# Altium schematic sheet Sheet1.SchDoc
size A3; SheetNumber: 1; SheetTotal: 2
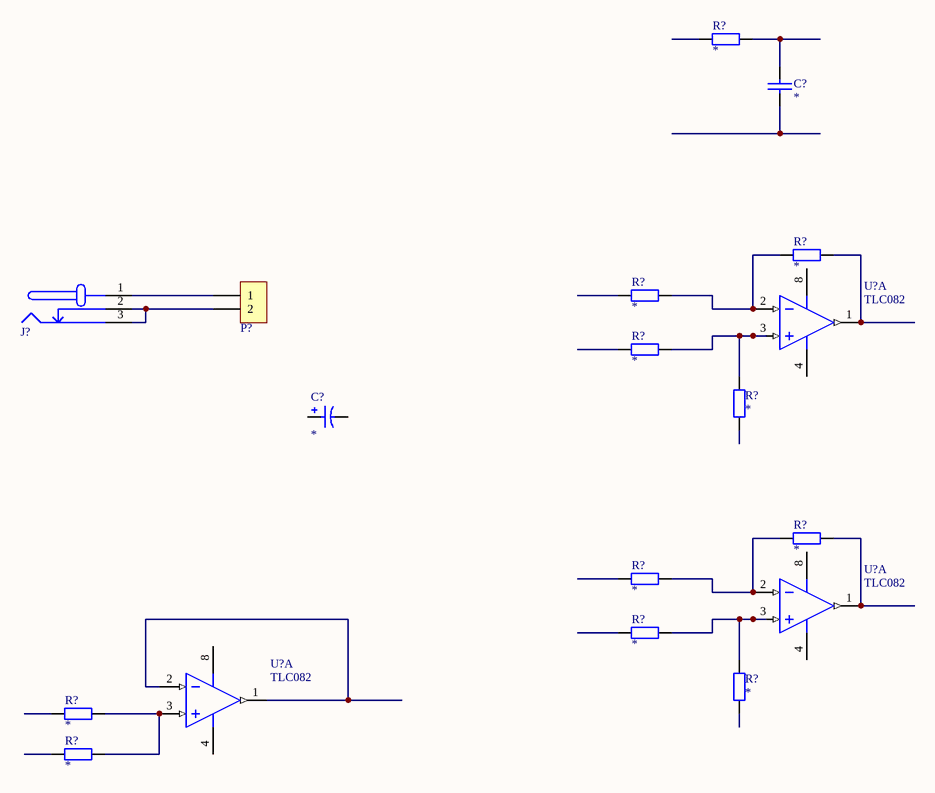
[diagram p0: Sheet1.SchDoc]

## Parts
(Parts that share a designator on the sheet are numbered #1, #2 ... from top to bottom, then left to right.)
C?#1  *  [0805 CAP]
C?#2  *  [CAP-RAD-2.5mm Pitch]
J?  DC barrel jack  [AC-Socket]  (value not drawn)
P?  Dual Banana Plugs  [Dual Banana Plug]  (value not drawn)
R?#1  *  [0805 RES]
R?#2  *  [0805 RES]
R?#3  *  [0805 RES]
R?#4  *  [0805 RES]
R?#5  *  [0805 RES]
R?#6  *  [0805 RES]
R?#7  *  [0805 RES]
R?#8  *  [0805 RES]
R?#9  *  [0805 RES]
R?#10  *  [0805 RES]
R?#11  *  [0805 RES]
U?#1  TLC082  [SO - 8]  (part A of 2)
U?#2  TLC082  [SO - 8]  (part A of 2)
U?#3  TLC082  [SO - 8]  (part A of 2)

## Nets
NetC?#1_1: C?#1.1 R?#1.2
NetJ?_1: J?.1(VCC) P?.1
NetJ?_2: J?.2(GND_ALT) J?.3(GND) P?.2
NetR?#2_1: R?#2.1 R?#3.2 U?#1.2(VINA-)
NetR?#2_2: R?#2.2 U?#1.1(VOUTA)
NetR?#4_2: R?#4.2 R?#5.1 U?#1.3(VINA+)
NetR?#6_1: R?#6.1 R?#7.2 U?#2.2(VINA-)
NetR?#6_2: R?#6.2 U?#2.1(VOUTA)
NetR?#8_2: R?#8.2 R?#9.1 U?#2.3(VINA+)
NetR?#10_2: R?#10.2 R?#11.2 U?#3.3(VINA+)
NetU?#3_1: U?#3.1(VOUTA) U?#3.2(VINA-)

Not connected (* = marked no-connect by the designer): C?#1 2; C?#2 1 2; R?#1 1; R?#3 1; R?#4 1; R?#5 2; R?#7 1; R?#8 1; R?#9 2; R?#10 1; R?#11 1; U?#1 4(VSS) 8(VDD); U?#2 4(VSS) 8(VDD); U?#3 4(VSS) 8(VDD)

## Library data of the parts
C?#1 = CerCap_SMT_0805: SMT ceramic capacitor 0805 size; Value: *
C?#2 = ElecCap_TH_2P0: Electrolytic capacitor with radial package, 2mm pitch and 5.2mm diameter; Published: 8-Jun-2000; LatestRevisionDate: 17-Jul-2002; LatestRevisionNote: Re-released for DXP Platform.; PackageReference: POLAR0.8; Publisher: Altium Limited; PackageDescription: Polarized Capacitor; 2 Leads; Value: *
J? = AC_Input: DC barrel jack connection to AC source; Value: socket
P? = AC_Output: Dual banana plugs connection to the AC load; LatestRevisionDate: 17-Jul-2002; LatestRevisionNote: Re-released for DXP Platform.; Publisher: Altium Limited
R?#1-R?#11 = Res_SMT_0805: 0805 resistor; Published: 8-Jun-2000; LatestRevisionDate: 17-Jul-2002; LatestRevisionNote: Re-released for DXP Platform.; PackageReference: AXIAL-0.4; Publisher: Altium Limited; Value: *; ComponentLink1Description: https://nz.mouser.com/datasheet/2/315/AOA0000C304-1149620.pdf
U?#1-U?#3 = TLC082_SMT_SOIC8: IC OPAMP GP 10MHZ 8SOIC; Manufacturer: Texas Instruments; Manufacturer Part Number: TLC082CDR; Amplifier Type: General Purpose; Slew Rate: 19 V/µs; Current - Supply: 1.9mA; Voltage - Supply, Single/Dual (±): 4.5 V ~ 16 V, ±2.25 V ~ 8 V; Supplier 1: Digi-Key; RoHS: RoHS Compliant; Category: Integrated Circuits (ICs); Stock 1: 29765; Pricing 1: 1=3.44, 10=3.087, 100=2.4808, 500=2.03822, 1000=1.68881 (NZD); Packaging: Cut Tape (CT); Part Status: Active; Output Type: -; Operating Temperature: 0°C ~ 70°C; Mounting Type: Surface Mount; Package / Case: 8-SOIC (0.154", 3.90mm Width); Supplier Device Package: 8-SOIC; Base Part Number: TLC082; ComponentLink1URL: http://www.ti.com/lit/ds/symlink/tlc080a.pdf; ComponentLink1Description: http://www.ti.com/lit/ds/symlink/tlc080a.pdf; Supplier Part Number 1: 296-2421-1-ND